# Altium schematic sheet rv_ledbrick_top.SchDoc
size A; SheetNumber: 1; SheetTotal: 6
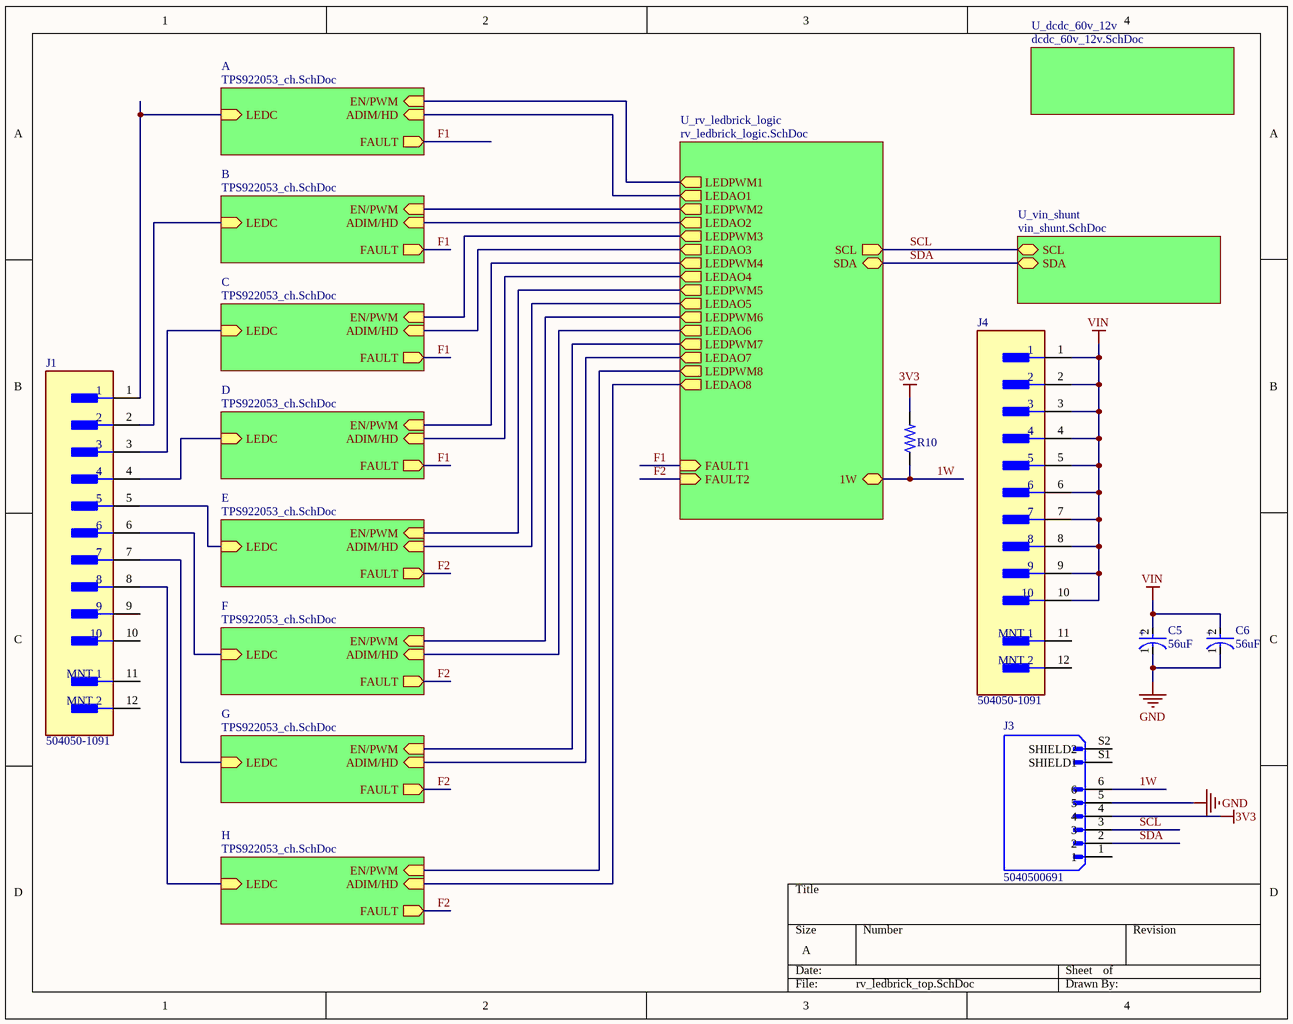
[diagram p0: rv_ledbrick_top.SchDoc]

## Parts
C5  value 56uF  [FP-OS-CON-SMT-F12-MFG]  (hidden comment: CAP 56uF 80V Poly)
C6  value 56uF  [FP-OS-CON-SMT-F12-MFG]  (hidden comment: CAP 56uF 80V Poly)
J1  504050-1091  [FP-504050-1091-MFG]
J3  5040500691  [MOLEX_5040500691]
J4  504050-1091  [FP-504050-1091-MFG]
R10  4.7k 0603 1%  [RESC1608-IPC-LL]  (value not drawn)

## Sub-sheets
A = TPS922053_ch.SchDoc: LEDC (in), ADIM/HD (in), EN/PWM (in), FAULT (out)
B = TPS922053_ch.SchDoc: LEDC (in), ADIM/HD (in), EN/PWM (in), FAULT (out)
C = TPS922053_ch.SchDoc: LEDC (in), ADIM/HD (in), EN/PWM (in), FAULT (out)
D = TPS922053_ch.SchDoc: LEDC (in), ADIM/HD (in), EN/PWM (in), FAULT (out)
E = TPS922053_ch.SchDoc: LEDC (in), ADIM/HD (in), EN/PWM (in), FAULT (out)
F = TPS922053_ch.SchDoc: LEDC (in), ADIM/HD (in), EN/PWM (in), FAULT (out)
G = TPS922053_ch.SchDoc: LEDC (in), ADIM/HD (in), EN/PWM (in), FAULT (out)
H = TPS922053_ch.SchDoc: LEDC (in), ADIM/HD (in), EN/PWM (in), FAULT (out)
U_dcdc_60v_12v = dcdc_60v_12v.SchDoc: no entries
U_rv_ledbrick_logic = rv_ledbrick_logic.SchDoc: SDA (bidir), SCL (out), LEDPWM1 (out), LEDPWM2 (out), LEDPWM3 (out), LEDPWM4 (out), LEDPWM5 (out), LEDPWM6 (out), LEDPWM7 (out), LEDPWM8 (out), LEDAO1 (out), LEDAO2 (out), LEDAO3 (out), LEDAO4 (out), LEDAO5 (out), LEDAO6 (out), LEDAO7 (out), LEDAO8 (out), FAULT1 (in), FAULT2 (in), 1W (bidir)
U_vin_shunt = vin_shunt.SchDoc: SCL (bidir), SDA (bidir)

## Nets
3V3: J3.4 R10.2
GND: C5.1(C) C6.1(C) J3.5
VIN: C5.2(A) C6.2(A) J4.1 J4.2 J4.3 J4.4 J4.5 J4.6 J4.7 J4.8 J4.9 J4.10
1W: J3.6 R10.1 ; sheet U_rv_ledbrick_logic/1W
F1: sheet A/FAULT, sheet B/FAULT, sheet C/FAULT, sheet D/FAULT, sheet U_rv_ledbrick_logic/FAULT1
F2: sheet E/FAULT, sheet F/FAULT, sheet G/FAULT, sheet H/FAULT, sheet U_rv_ledbrick_logic/FAULT2
SCL: J3.3 ; sheet U_rv_ledbrick_logic/SCL, sheet U_vin_shunt/SCL
SDA: J3.2 ; sheet U_rv_ledbrick_logic/SDA, sheet U_vin_shunt/SDA
NetJ1_1: J1.1 ; sheet A/LEDC
NetJ1_2: J1.2 ; sheet B/LEDC
NetJ1_3: J1.3 ; sheet C/LEDC
NetJ1_4: J1.4 ; sheet D/LEDC
NetJ1_5: J1.5 ; sheet E/LEDC
NetJ1_6: J1.6 ; sheet F/LEDC
NetJ1_7: J1.7 ; sheet G/LEDC
NetJ1_8: J1.8 ; sheet H/LEDC
(unnamed): sheet A/ADIM/HD, sheet U_rv_ledbrick_logic/LEDAO1
(unnamed): sheet A/EN/PWM, sheet U_rv_ledbrick_logic/LEDPWM1
(unnamed): sheet B/ADIM/HD, sheet U_rv_ledbrick_logic/LEDAO2
(unnamed): sheet B/EN/PWM, sheet U_rv_ledbrick_logic/LEDPWM2
(unnamed): sheet C/ADIM/HD, sheet U_rv_ledbrick_logic/LEDAO3
(unnamed): sheet C/EN/PWM, sheet U_rv_ledbrick_logic/LEDPWM3
(unnamed): sheet D/ADIM/HD, sheet U_rv_ledbrick_logic/LEDAO4
(unnamed): sheet D/EN/PWM, sheet U_rv_ledbrick_logic/LEDPWM4
(unnamed): sheet E/ADIM/HD, sheet U_rv_ledbrick_logic/LEDAO5
(unnamed): sheet E/EN/PWM, sheet U_rv_ledbrick_logic/LEDPWM5
(unnamed): sheet F/ADIM/HD, sheet U_rv_ledbrick_logic/LEDAO6
(unnamed): sheet F/EN/PWM, sheet U_rv_ledbrick_logic/LEDPWM6
(unnamed): sheet G/ADIM/HD, sheet U_rv_ledbrick_logic/LEDAO7
(unnamed): sheet G/EN/PWM, sheet U_rv_ledbrick_logic/LEDPWM7
(unnamed): sheet H/ADIM/HD, sheet U_rv_ledbrick_logic/LEDAO8
(unnamed): sheet H/EN/PWM, sheet U_rv_ledbrick_logic/LEDPWM8

Not connected (* = marked no-connect by the designer): J1 9 10 11(MNT_1) 12(MNT_2); J3 1 S1(SHIELD1) S2(SHIELD2); J4 11(MNT_1) 12(MNT_2)

## Notes on the sheet
- (in symbol CMP-001-00120-1) +

## Library data of the parts
C5 C6 = CMP-001-00120-1: Conductive Polymer Aluminum Solid Capacitor 56uF 20% 80V Surface Mount T/R; ESR (Equivalent Series Resistance): 28mR; Mounting Technology: Surface Mount; Min Operating Temperature: -55°C; RoHS Compliant: Yes; Max Operating Temperature: 125°C; Voltage Rating: 80V; Series: OS-CON™, SXV; Tolerance: 20%; Case/Package: Radial
J1 J4 = CMP-002-00088-1: Conn Wire to Board HDR 10 POS 1.5mm Solder RA SMD Pico-Lock™ T/R
J3 = CMP-253-000000-2: CONN WIRE TO BOARD RA 6POS; Number of Circuits: 6; Gender: Male; Voltage Rating: 150V; Connector Type: Blade Pin; Current Rating: 3A; Glow Wire Compliant: Non-compliant; Pitch: 1.5mm; Component Type: Standard; Pin Count: 8; Housing Color: Black; Min Operating Temperature: -25°C; Halogen Free: Low Halogen; Value: *; Number of Positions: 6; Orientation: Right Angle; Color: Black; Design Item ID: 5040500691; Availability: Unavailable; Price: None; Max Operating Temperature: 85°C; Packaging: Tape and Reel; Length: 13.55mm; Number of Rows: 1; Contact Gender: Male; Number of Contacts: 6; Contact Plating: Gold; Package Quantity: 2700; Radiation Hardening: No; Termination: SMD/SMT; Contact Material: Copper Alloy,Copper; Source: 5040500691.SchLib; RoHS Compliant: Yes; Housing Material: Thermoplastic; MP: 5040500691; Flammability Rating: UL94 V-0; Mounting Technology: Surface Mount; Package: None; Depth: 6.44mm
R10 = CMP-009-00205-1: RES SMD 4.7K OHM 1% 1/10W 0603